# Altium schematic sheet iotaCore-Power.SchDoc
size A; SheetNumber: 3; SheetTotal: 4
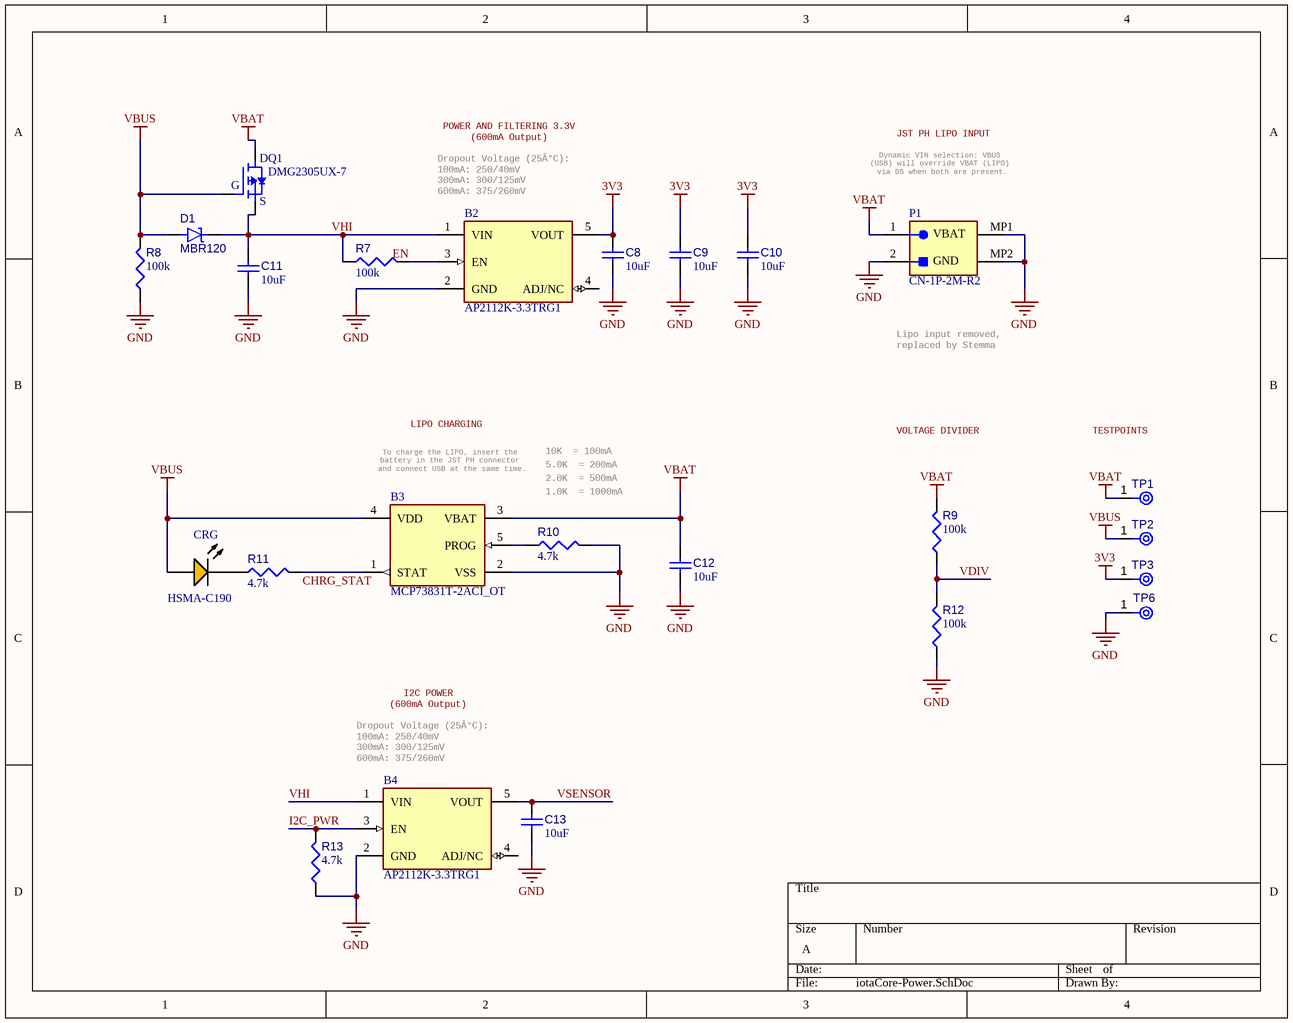
[diagram p0: iotaCore-Power.SchDoc]

## Parts
B2  AP2112K-3.3TRG1  [SOT95P270X145-5N]
B3  MCP73831T-2ACI_OT  [SOT95P270X145-5N]
B4  AP2112K-3.3TRG1  [SOT95P270X145-5N]
C8  value 10uF  [CAPC1608X87X35NL15T15]  (hidden comment: Capacitor 10 uF +/- 0.25 uF 50 V 0603)
C9  value 10uF  [CAPC1608X87X35NL15T15]  (hidden comment: Capacitor 10 uF +/- 0.25 uF 50 V 0603)
C10  value 10uF  [CAPC1608X87X35NL15T15]  (hidden comment: Capacitor 10 uF +/- 0.25 uF 50 V 0603)
C11  value 10uF  [CAPC1608X87X35NL15T15]  (hidden comment: Capacitor 10 uF +/- 0.25 uF 50 V 0603)
C12  value 10uF  [CAPC1608X87X35NL15T15]  (hidden comment: Capacitor 10 uF +/- 0.25 uF 50 V 0603)
C13  value 10uF  [CAPC1608X87X35NL15T15]  (hidden comment: Capacitor 10 uF +/- 0.25 uF 50 V 0603)
CRG  HSMA-C190  [AVAG-HSMX-C190_V]
D1  MBR120  [ONSC-SOD-123FL-2-498-01_V]
P1  CN-1P-2M-R2  [JST- S2B-PH-SM4-TB(LF)(SN)-2_V]
Q1  DMG2305UX-7  [FP-SOT23-MFG]
R7  value 100k  [RESC1608X55X25ML10T15]  (hidden comment: Resistor 100k +/-1% 0603 100 mW)
R8  value 100k  [RESC1608X55X25ML10T15]  (hidden comment: Resistor 100k +/-1% 0603 100 mW)
R9  value 100k  [RESC1608X55X25ML10T15]  (hidden comment: Resistor 100k +/-1% 0603 100 mW)
R10  value 4.7k  [RESC1608X55X25ML10T15]  (hidden comment: Resistor 4.7k +/-1% 0603 100 mW)
R11  value 4.7k  [RESC1608X55X25ML10T15]  (hidden comment: Resistor 1k +/-1% 0603 100 mW)
R12  value 100k  [RESC1608X55X25ML10T15]  (hidden comment: Resistor 100k +/-1% 0603 100 mW)
R13  value 4.7k  [RESC1608X55X25ML10T15]  (hidden comment: Resistor 4.7k +/-1% 0603 100 mW)
TP1  TPAD6R  [TP06R]  (value not drawn)  (no BOM)
TP2  TPAD6R  [TP06R]  (value not drawn)  (no BOM)
TP3  TPAD6R  [TP06R]  (value not drawn)  (no BOM)
TP6  TPAD6R  [TP06R]  (value not drawn)  (no BOM)

## Nets
3V3: B2.5(VOUT) C8.2 C9.2 C10.2 TP3.1(TP)
GND: B2.2(GND) B3.2(VSS) B4.2(GND) C8.1 C9.1 C10.1 C11.1 C12.1 C13.1 P1.2 P1.MP1 P1.MP2 R8.1 R10.2 R12.1 R13.1 TP6.1(TP)
VBAT: B3.3(VBAT) C12.2 P1.1 Q1.3(D) R9.2 TP1.1(TP)
VBUS: B3.4(VDD) CRG.1(A) D1.2(A) Q1.1(G) R8.2 TP2.1(TP)
CHRG_STAT: B3.1(STAT) R11.2
EN: B2.3(EN) R7.2
I2C_PWR: B4.3(EN) R13.2
VDIV: R9.1 R12.2
VHI: B2.1(VIN) B4.1(VIN) C11.2 D1.1(K) Q1.2(S) R7.1
VSENSOR: B4.5(VOUT) C13.2
NetB3_5: B3.5(PROG) R10.1
NetCRG_2: CRG.2(K) R11.1

Not connected (* = marked no-connect by the designer): B2 4(ADJ/NC); B4 4(ADJ/NC)

## Notes on the sheet
- POWER AND FILTERING 3.3V
  (600mA Output)
- JST PH LIPO INPUT
- Dropout Voltage (25Â°C):
  100mA: 250/40mV
  300mA: 300/125mV
  600mA: 375/260mV
- Dynamic VIN selection: VBUS
  (USB) will override VBAT (LIPO)
  via D5 when both are present.
- Lipo input removed, replaced by Stemma
- LIPO CHARGING
- VOLTAGE DIVIDER
- TESTPOINTS
- To charge the LIPO, insert the
  battery in the JST PH connector
  and connect USB at the same time.
- 10K  = 100mA
- 5.0K  = 200mA
- 2.0K  = 500mA
- 1.0K  = 1000mA
- I2C POWER
  (600mA Output)
- (in symbol CMP-005-000001-1) VBAT; GND

## Library data of the parts
B2 B4 = CMP-007-000001-1: 600mA 3.3V LDO Regulator Enable SOT23-5 DiodesZetex AP2112K-3.3TRG1, LDO Voltage Regulator, 3.3 V +/-1.5%, 2.5  6 Vin, 5-Pin SOT-23; Manufacturer_Name: Diodes Inc.; Geometry.Height: 1.3mm; Mouser Part Number: 621-AP2112K-3.3TRG1; Source: AP2112K-3.3TRG1.SchLib; Datasheet Link: *; Manufacturer_Part_Number: AP2112K-3.3TRG1; Mouser Price/Stock: https://www.mouser.co.uk/ProductDetail/Diodes-Incorporated/AP2112K-3.3TRG1?qs=x6A8l6qLYDDPYHosCdzh%2FA%3D%3D; Design Item ID: AP2112K-3.3TRG1
B3 = CMP-009-000000-1: Li-Ion Charge Controller 4.2V SOT23-5; Manufacturer_Name: Microchip; Manufacturer_Part_Number: MCP73831T-2ACI/OT; Geometry.Height: 1.45mm; Design Item ID: MCP73831T-2ACI_OT; Mouser Part Number: 579-MCP73831T-2ACIOT; Datasheet Link: http://ww1.microchip.com/downloads/en/DeviceDoc/20001984g.pdf; Source: MCP73831T-2ACI_OT.SchLib; Mouser Price/Stock: https://www.mouser.co.uk/ProductDetail/Microchip-Technology-Atmel/MCP73831T-2ACI-OT?qs=yUQqVecv4qvbBQBGbHx0Mw%3D%3D
C8-C13 = CMP-001-00012-6: Chip Capacitor, 10 uF, +/- 0.25 uF, 50 V, 0603 (1608 Metric); Tolerance: 0.25%; Capacitor Type: Ceramic; Voltage Rating: 50V; Max Operating Temperature: 125°C; RoHS Compliant: True; Mounting Technology: SM; Pins: 2; Case/Package: 0603; Min Operating Temperature: -55°C
CRG = CMP-007-00011-2: LED Uni-Color Amber, 60 mW, 20 mA, -40 to 85 degC, 2-Pin SMD, RoHS, Tape and Reel; Manufacturer: Avago; Forward Current: 20mA; Luminous Intensity: 90mcd; Lens Style: Diffused; Power: 60mW; Nominal Vf: 1.9V; Viewing Angle: 170degrees; Illumination Colour: Orange; Datasheet Version: Sep-10; Mounting Technology: SM; Case/Package: 0603; RoHS Compliant: True; Pins: 2; Packaging: TapeandReel; Colour: Orange; Package Reference: HSMX-C190; Manufacturer URL: http://www.avagotech.com/; Package Quantity: 4000; Min Operating Temperature: -40°C; Datasheet URL: http://docs.avagotech.com/docs/AV02-0112EN; Max Operating Temperature: 85°C; Forward Voltage: 1.9V; Package Description: 2-Pin Surface Mount Device, Body 1.6 x 0.8 mm, Height 0.9 mm
D1 = CMP-004-00031-1: Diode; Source: MBR120.SchLib; Design Item ID: MBR120
P1 = CMP-005-000001-1: Design Item ID: CN-1P-2M-R2; Source: CN-1P-2M-R2.SchLib
Q1 = CMP001-1: Power Field-Effect Transistor, 4.2A I(D), 20V, 0.052ohm, 1-Element, P-Channel, Silicon, Metal-oxide Semiconductor FET; Max Operating Temperature: 150°C; RoHS Compliant: Yes; Pins: 3
R7-R9 R12 = CMP-009-00023-5: Chip Resistor, 100 KOhm, +/- 1%, 0.1 W, -55 to 155 degC, 0603 (1608 Metric); Voltage Rating: 50V; Power: 100mW; Max Operating Temperature: 155°C; RoHS Compliant: True; Tolerance: 1%; Pins: 2; Case/Package: 0603; Mounting Technology: SM; Min Operating Temperature: -55°C
R10 R13 = CMP-009-00023-5: Chip Resistor, 4.7 KOhm, +/- 1%, 0.1 W, -55 to 155 degC, 0603 (1608 Metric); Voltage Rating: 50V; Power: 100mW; Max Operating Temperature: 155°C; RoHS Compliant: True; Tolerance: 1%; Pins: 2; Case/Package: 0603; Mounting Technology: SM; Min Operating Temperature: -55°C
R11 = CMP-009-00023-5: Chip Resistor, 1 KOhm, +/- 1%, 0.1 W, -55 to 155 degC, 0603 (1608 Metric); Voltage Rating: 50V; Power: 100mW; Max Operating Temperature: 155°C; RoHS Compliant: True; Tolerance: 1%; Pins: 2; Case/Package: 0603; Mounting Technology: SM; Min Operating Temperature: -55°C
TP1-TP3 TP6 = CMP-00028-00002-2: 0.6mm round; Pins: 1